# Altium schematic sheet NMT_RS_232.SCHDOC
size A4; Organization: Altium Limited; Address1: L3, 12a Rodborough Rd; Address2: Frenchs Forest; Address3: NSW; Address4: Australia 2086; DocumentNumber: 9; SheetNumber: 5; SheetTotal: 13
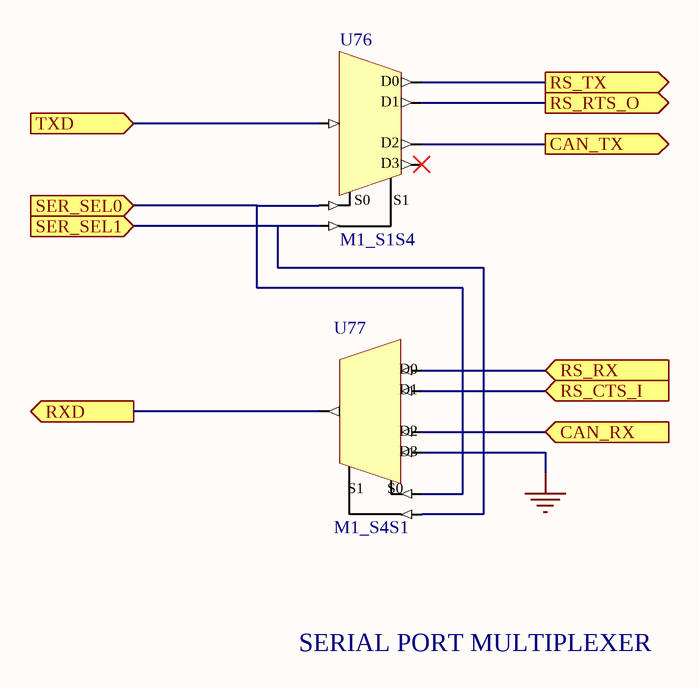
[diagram p0: NMT_RS_232.SCHDOC]

## Parts
U76  M1_S1S4
U77  M1_S4S1

## Ports
CAN_RX (in), CAN_TX (out), RS_CTS_I (in), RS_RTS_O (out), RS_RX (in), RS_TX (out), RXD (out), SER_SEL0 (in), SER_SEL1 (in), TXD (in)

## Nets
GND: U77.D3
CAN_RX: U77.D2 ; port CAN_RX
CAN_TX: U76.D2 ; port CAN_TX
RS_CTS_I: U77.D1 ; port RS_CTS_I
RS_RTS_O: U76.D1 ; port RS_RTS_O
RS_RX: U77.D0 ; port RS_RX
RS_TX: U76.D0 ; port RS_TX
RXD: U77.O ; port RXD
SER_SEL0: U76.S0 U77.S0 ; port SER_SEL0
SER_SEL1: U76.S1 U77.S1 ; port SER_SEL1
TXD: U76.O ; port TXD

Not connected (* = marked no-connect by the designer): U76 D3*

## Notes on the sheet
- SERIAL PORT MULTIPLEXER
- Title
- Size:
- Date:
- A4
- Number:
- Time:
- Revision:
- Sheet
- of
- File:

## Library data of the parts
U76 = M1_S1S4: 1x1-Single Wire to 4x1-Single Wire Multiplexer (Demultiplex); ArchiveName: GENERIC; Published: 4-Dec-2003; Publisher: Altium Limited; Core Revision: 1.00.00
U77 = M1_S4S1: 4x1-Single Wire to 1x1-Single Wire Multiplexer; ArchiveName: GENERIC; Published: 4-Dec-2003; Publisher: Altium Limited; Core Revision: 1.00.00